# Altium project alarmEWSI.PrjPcb
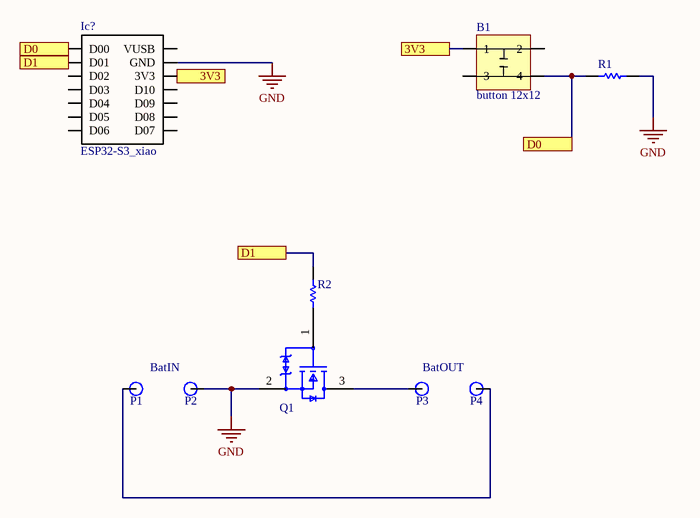
[diagram p0: alarm.SchDoc]
1 sheet, 9 parts. Net scope: flat (ports and power ports of the same name join across sheets).
Board file: alarm.PcbDoc

## Sheet alarm.SchDoc
size A4; SheetNumber: 1; SheetTotal: 1

### Parts
B1  button 12x12  [button12x12]
Ic?  ESP32-S3_xiao  [ESP32-S3]
P1  Pin  [Pin]  (value not drawn)
P2  Pin  [Pin]  (value not drawn)
P3  Pin  [Pin]  (value not drawn)
P4  Pin  [Pin]  (value not drawn)
Q1  DMG2302UK-7  [FP-SOT23-MFG]  (value not drawn)
R1  RC1206FR-10750RL  [RESC3116X65X40LL10T20]  (value not drawn)
R2  RC1206FR-10750RL  [RESC3116X65X40LL10T20]  (value not drawn)

### Ports
3V3 (see alarm[2B]), 3V3 (see alarm[3B]), D0 (see alarm[2B]), D0 (see alarm[3B]), D1 (see alarm[2B])

### Nets
GND: Ic?.13(GND) P2.1 Q1.2(S) R1.2
NetB1_1: B1.1 Ic?.12(3V3) ; port 3V3
NetB1_4: B1.4 Ic?.1(D00) R1.1 ; port D0
NetIc?_2: Ic?.2(D01) R2.2 ; port D1
NetP1_1: P1.1 P4.1
NetP3_1: P3.1 Q1.3(D)
NetQ1_1: Q1.1(G) R2.1

Not connected (* = marked no-connect by the designer): B1 2 3; Ic? 3(D02) 4(D03) 5(D04) 6(D05) 7(D06) 8(D07) 9(D08) 10(D09) 11(D10) 14(VUSB)

### Notes on the sheet
- BatIN
- BatOUT

### Library data of the parts
B1 = button12x12
Q1 = CMP-12801-000001-1: MOSFET N-CH 20V 2.8A SOT23; Manufacturer: Diodes Inc.; Reverse Recovery Time: 5.3ns; Gate Charge At Vgs: 2.8nC @ 10V; Turn On Delay Time: 0.6ns; Pulse Drain Current: 12A; Max Forward Diode Voltage: 1.2V; Reverse Recovery Charge: 0.5nC; Automotive Grade: Grade 0; Threshold Vgs Min: 0.3V; Number Of N Channels: 1; Standoff Height: 0.013mm; Typ Forward Diode Voltage: 0.7V; Drain To Source Resistance: 61mΩ; Rthja Max: 192°C/W; Max Junction Temp: +150°C; Input Capacitace At Vds: 130pF @ 10V; Threshold Vgs Max: 1V; Turn Off Delay Time: 4.2ns; Depletion Mode: False; Gate To Source Voltage: 12V; Power Dissipation: 0.66W; Device Class L1: Discrete Semiconductors; Footprint Url: https://www.diodes.com/assets/Package-Files/SOT23.pdf; Lead Free: Yes; Manufacturer Part Number: DMG2302UK-7; Temperature Range High: +150°C; Drain To Source Voltage: 20V; Category: Trans; Digikey Description: MOSFET N-CH 20V 2.8A SOT23; RoHS: TRUE; Device Class L2: Transistors; Height: 1.1mm; Automotive: Yes; Package: SOT23; Drain To Source Breakdown Voltage: 20V; Continuous Drain Current: 2.8A; ComponentLink2Description: Datasheet; Device Class L3: MOSFETs; Octopart: https://octopart.com/dmg2302uk-7-diodes+inc.-73850182; Temperature Range Low: -55°C; Temperature: -55°C to +150°C; Number Of Channels: 1; ComponentLink2URL: https://www.diodes.com/assets/Datasheets/DMG2302UK.pdf
R1 R2 = CMP-2003-04964-1: Manufacturer: Yageo; Part Number: RC1206FR-10750RL